# Altium schematic sheet Microfono.SchDoc: Microfono
size A4; Author: Jose Luis Llorente Gonzalez; CompanyName: ETSIT; Organization: UPM; Revision: V1.0
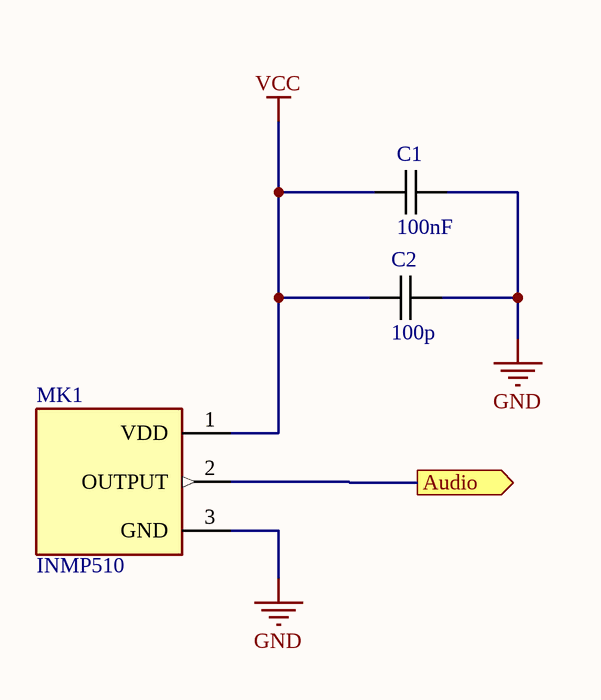
[diagram p0: Microfono.SchDoc]

## Parts
C1  100nF  [0805C-TBD]
C2  100p  [0805C-GENERIC]
MK1  INMP510  [XDCR_INMP510]

## Ports
Audio (out)

## Nets
GND: C1.2 C2.2 MK1.3(GND)
VCC: C1.1 C2.1 MK1.1(VDD)
Audio: MK1.2(OUTPUT) ; port Audio

## Notes on the sheet
- Title
- Size:
- Date:
- A4
- Number:
- Time:
- Revision:
- Sheet
- of
- File:

## Library data of the parts
C1 = 0805C-100nF-25V-X7R-MUR: CAPACITOR 0805 CERAMIC; Supplier 1: Digi-Key; Supplier Part Number 1: 490-1673-1-ND
C2 = C0805-GENERIC: GENERIC CAPACITOR NON POLARISED0603
MK1 = INMP510: 60Hz ~ 20kHz Analog Microphone MEMS _Silicon_ 1.5V ~ 3.63V Omnidirectional _-38dB Â±2dB @ 94dB SPL_ Solder Pads; MF: TDK InvenSense; Value: *; MP: INMP510; SnapEDA_Link: https://www.snapeda.com/parts/INMP510/TDK%20InvenSense/view-part/2757133/?ref=snap; Package: LGA-3 TDK-InvenSense; Digi-Key_Part_Number: 1428-1016-2-ND; Digi-Key_Purchase_URL: https://www.digikey.com/product-detail/en/tdk-invensense/INMP510ACEZ-R7/1428-1016-2-ND/4311534?utm_source=snapeda&utm_medium=aggregator&utm_campaign=symbol